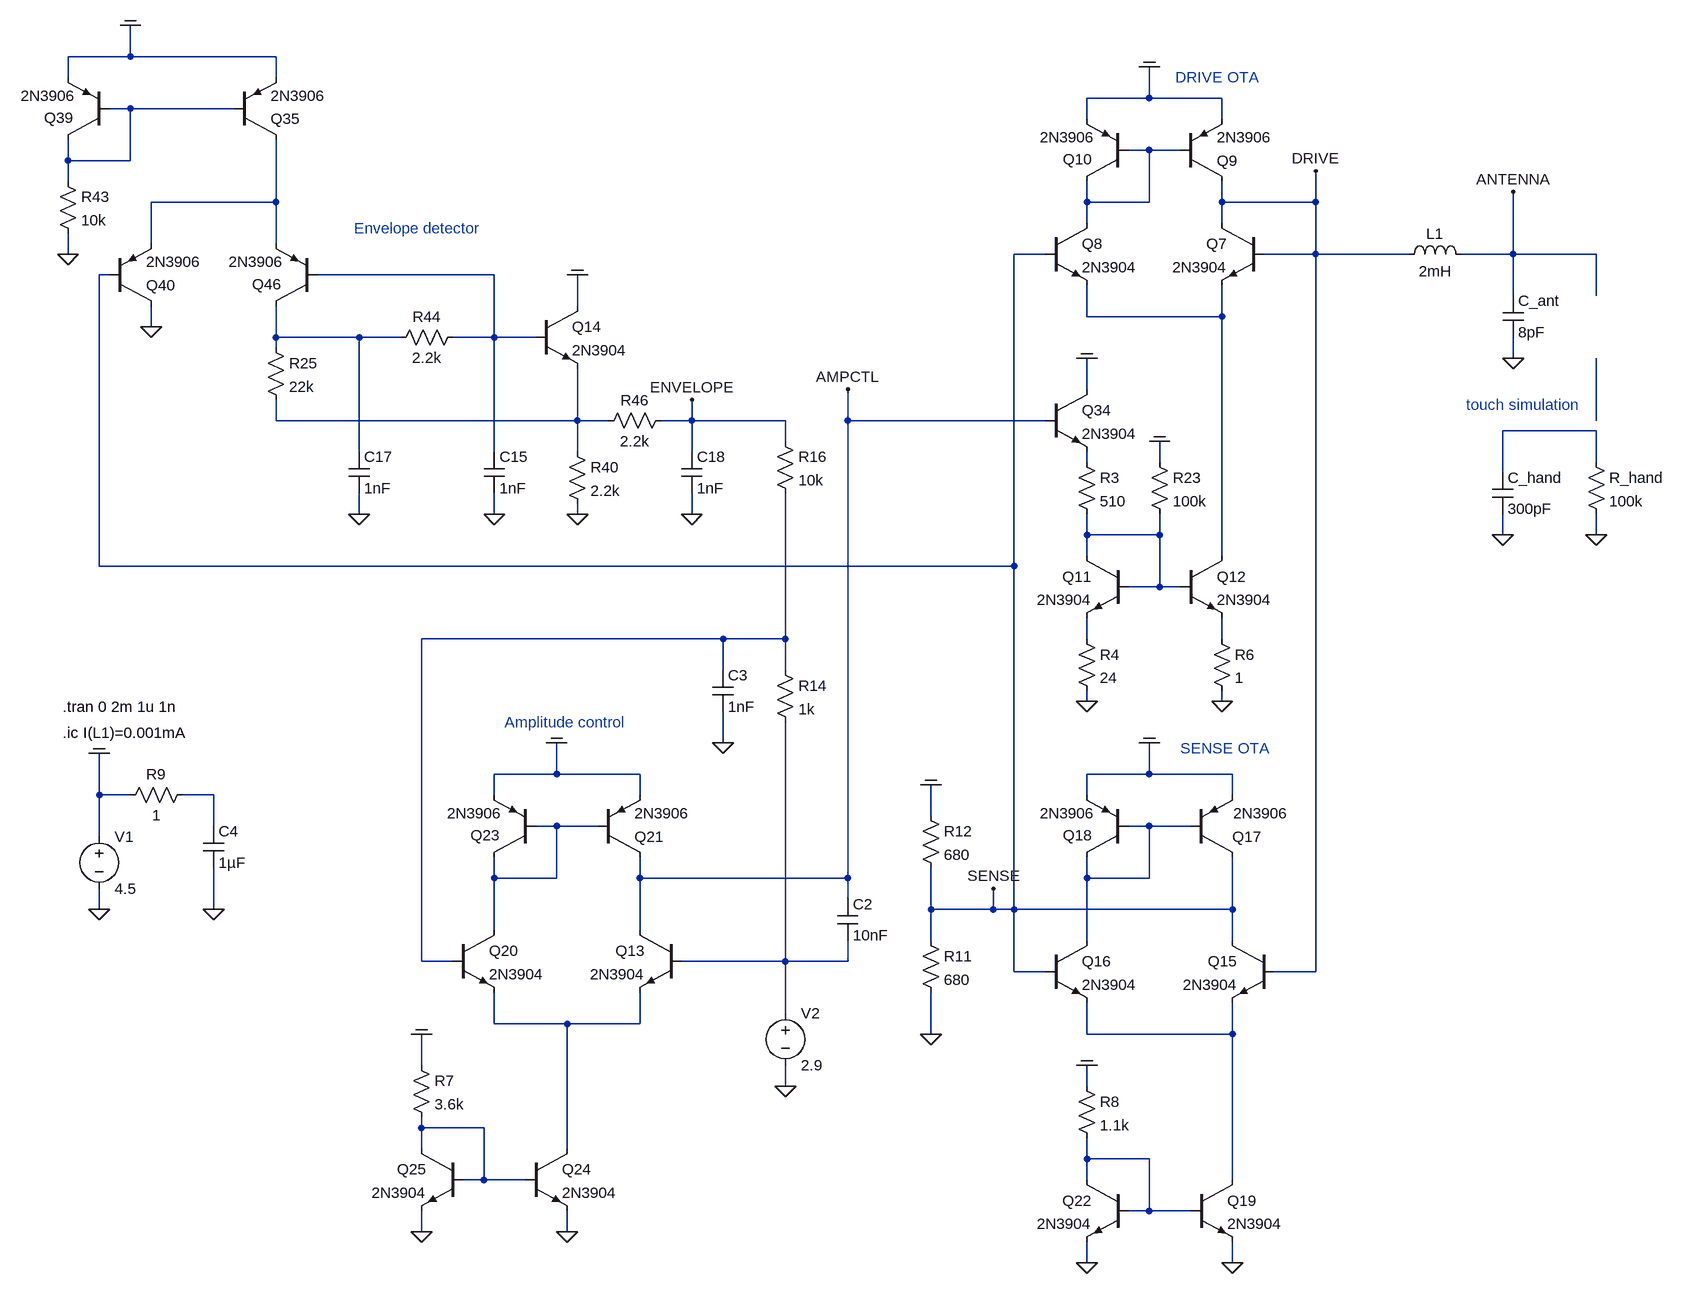
[diagram p0: schematic bjt_current_sensing_oscillator_ota_v8.asc]
bjt_current_sensing_oscillator_ota_v8.asc, the LTspice schematic file:
Version 4
SHEET 1 4648 5684
WIRE -624 1456 -624 1408
WIRE -624 1456 -720 1456
WIRE -400 1456 -624 1456
WIRE -720 1488 -720 1456
WIRE -400 1488 -400 1456
WIRE 944 1520 944 1472
WIRE 944 1520 848 1520
WIRE 1056 1520 944 1520
WIRE -624 1536 -656 1536
WIRE -464 1536 -624 1536
WIRE 848 1552 848 1520
WIRE 1056 1552 1056 1520
WIRE 944 1600 912 1600
WIRE 992 1600 944 1600
WIRE -720 1616 -720 1584
WIRE -624 1616 -624 1536
WIRE -624 1616 -720 1616
WIRE -720 1648 -720 1616
WIRE -400 1680 -400 1584
WIRE -400 1680 -592 1680
WIRE 848 1680 848 1648
WIRE 944 1680 944 1600
WIRE 944 1680 848 1680
WIRE 1056 1680 1056 1648
WIRE 1200 1680 1200 1632
WIRE 1200 1680 1056 1680
WIRE 848 1712 848 1680
WIRE 1056 1712 1056 1680
WIRE -592 1744 -592 1680
WIRE -400 1744 -400 1680
WIRE -720 1760 -720 1728
WIRE 784 1760 736 1760
WIRE 1200 1760 1200 1680
WIRE 1200 1760 1120 1760
WIRE 1344 1760 1200 1760
WIRE 1504 1760 1504 1664
WIRE 1504 1760 1424 1760
WIRE 1632 1760 1504 1760
WIRE -656 1792 -672 1792
WIRE -64 1792 -336 1792
WIRE 1504 1824 1504 1760
WIRE 1632 1824 1632 1760
WIRE 64 1840 64 1792
WIRE 848 1856 848 1808
WIRE 1056 1856 1056 1808
WIRE 1056 1856 848 1856
WIRE -592 1872 -592 1840
WIRE -400 1888 -400 1840
WIRE -272 1888 -400 1888
WIRE -208 1888 -272 1888
WIRE -64 1888 -64 1792
WIRE -64 1888 -128 1888
WIRE 0 1888 -64 1888
WIRE -400 1904 -400 1888
WIRE 1504 1920 1504 1888
WIRE 848 1968 848 1920
WIRE -400 2016 -400 1984
WIRE 64 2016 64 1936
WIRE 64 2016 -400 2016
WIRE 112 2016 64 2016
WIRE 240 2016 240 1984
WIRE 240 2016 192 2016
WIRE 384 2016 240 2016
WIRE 480 2016 480 1968
WIRE 784 2016 480 2016
WIRE 1632 2016 1632 1920
WIRE 1632 2032 1488 2032
WIRE 384 2048 384 2016
WIRE -272 2064 -272 1888
WIRE -64 2064 -64 1888
WIRE 64 2064 64 2016
WIRE 240 2064 240 2016
WIRE 848 2080 848 2064
WIRE 960 2080 960 2048
WIRE 1632 2080 1632 2032
WIRE 1488 2096 1488 2032
WIRE -272 2160 -272 2128
WIRE -64 2160 -64 2128
WIRE 64 2160 64 2144
WIRE 240 2160 240 2128
WIRE 848 2192 848 2160
WIRE 960 2192 960 2160
WIRE 960 2192 848 2192
WIRE 1488 2192 1488 2160
WIRE 1632 2192 1632 2160
WIRE 848 2224 848 2192
WIRE 1056 2224 1056 1856
WIRE -672 2240 -672 1792
WIRE 736 2240 736 1760
WIRE 736 2240 -672 2240
WIRE 960 2272 960 2192
WIRE 960 2272 912 2272
WIRE 992 2272 960 2272
WIRE 288 2352 -176 2352
WIRE 384 2352 384 2128
WIRE 384 2352 288 2352
WIRE 848 2352 848 2320
WIRE 1056 2352 1056 2320
WIRE 288 2400 288 2352
WIRE 384 2400 384 2352
WIRE 848 2448 848 2432
WIRE 1056 2448 1056 2432
WIRE 288 2512 288 2464
WIRE 32 2560 32 2512
WIRE 32 2560 -64 2560
WIRE 160 2560 32 2560
WIRE 944 2560 944 2512
WIRE 944 2560 848 2560
WIRE 1072 2560 944 2560
WIRE -672 2592 -672 2528
WIRE -624 2592 -672 2592
WIRE -496 2592 -544 2592
WIRE -64 2592 -64 2560
WIRE 160 2592 160 2560
WIRE 848 2592 848 2560
WIRE 1072 2592 1072 2560
WIRE 608 2624 608 2576
WIRE -496 2640 -496 2592
WIRE 32 2640 0 2640
WIRE 96 2640 32 2640
WIRE 944 2640 912 2640
WIRE 1008 2640 944 2640
WIRE -672 2656 -672 2592
WIRE -64 2720 -64 2688
WIRE 32 2720 32 2640
WIRE 32 2720 -64 2720
WIRE 160 2720 160 2688
WIRE 480 2720 480 2016
WIRE 480 2720 160 2720
WIRE 848 2720 848 2688
WIRE 944 2720 944 2640
WIRE 944 2720 848 2720
WIRE 480 2752 480 2720
WIRE -672 2768 -672 2736
WIRE -496 2768 -496 2704
WIRE 608 2768 608 2704
WIRE 704 2768 704 2736
WIRE 704 2768 608 2768
WIRE 736 2768 736 2240
WIRE 736 2768 704 2768
WIRE 1072 2768 1072 2688
WIRE 1072 2768 736 2768
WIRE -64 2800 -64 2720
WIRE 160 2800 160 2720
WIRE 608 2816 608 2768
WIRE 848 2816 848 2720
WIRE 1072 2816 1072 2768
WIRE -176 2848 -176 2352
WIRE -128 2848 -176 2848
WIRE 384 2848 384 2480
WIRE 384 2848 224 2848
WIRE 480 2848 480 2816
WIRE 480 2848 384 2848
WIRE 736 2864 736 2768
WIRE 784 2864 736 2864
WIRE 1200 2864 1200 1760
WIRE 1200 2864 1136 2864
WIRE 384 2928 384 2848
WIRE -64 2944 -64 2896
WIRE 48 2944 -64 2944
WIRE 160 2944 160 2896
WIRE 160 2944 48 2944
WIRE 608 2960 608 2896
WIRE 848 2960 848 2912
WIRE 1072 2960 1072 2912
WIRE 1072 2960 848 2960
WIRE -176 3008 -176 2960
WIRE 384 3040 384 3008
WIRE 848 3040 848 3008
WIRE -176 3104 -176 3088
WIRE -80 3104 -176 3104
WIRE -176 3136 -176 3104
WIRE 48 3136 48 2944
WIRE 848 3152 848 3120
WIRE 944 3152 848 3152
WIRE -80 3184 -80 3104
WIRE -80 3184 -112 3184
WIRE -16 3184 -80 3184
WIRE 848 3184 848 3152
WIRE 1072 3184 1072 2960
WIRE 944 3232 944 3152
WIRE 944 3232 912 3232
WIRE 1008 3232 944 3232
WIRE -176 3264 -176 3232
WIRE 48 3264 48 3232
WIRE 848 3312 848 3280
WIRE 1072 3312 1072 3280
FLAG 1504 1920 0
FLAG 1504 1664 ANTENNA
FLAG -672 2768 0
FLAG -672 2528 COM
FLAG 1488 2192 0
FLAG 1632 2192 0
FLAG -496 2768 0
FLAG 944 1472 COM
FLAG 944 2512 COM
FLAG 1072 3312 0
FLAG 848 3008 COM
FLAG 608 2960 0
FLAG 608 2576 COM
FLAG 704 2736 SENSE
FLAG 848 2448 0
FLAG 1056 2448 0
FLAG 960 2048 COM
FLAG -624 1408 COM
FLAG -272 2160 0
FLAG -720 1760 0
FLAG -592 1872 0
FLAG 64 1792 COM
FLAG 64 2160 0
FLAG -64 2160 0
FLAG 848 1920 COM
FLAG 240 2160 0
FLAG 32 2512 COM
FLAG 48 3264 0
FLAG -176 2960 COM
FLAG -176 3264 0
FLAG 384 3040 0
FLAG 288 2512 0
FLAG 848 3312 0
FLAG 240 1984 ENVELOPE
FLAG 480 1968 AMPCTL
FLAG 1200 1632 DRIVE
SYMBOL ind 1328 1776 R270
WINDOW 0 32 56 VTop 2
WINDOW 3 5 56 VBottom 2
SYMATTR InstName L1
SYMATTR Value 2mH
SYMATTR SpiceLine Ipk=100m Rser=120 Rpar=10Meg Cpar=1pF
SYMBOL cap 1488 1824 R0
SYMATTR InstName C_ant
SYMATTR Value 8pF
SYMBOL voltage -672 2640 R0
WINDOW 123 0 0 Left 0
WINDOW 39 0 0 Left 0
SYMATTR InstName V1
SYMATTR Value 4.5
SYMBOL cap 1472 2096 R0
SYMATTR InstName C_hand
SYMATTR Value 300pF
SYMBOL res 1616 2064 R0
WINDOW 0 36 40 Left 2
WINDOW 3 36 76 Left 2
SYMATTR InstName R_hand
SYMATTR Value 100k
SYMBOL cap -512 2640 R0
SYMATTR InstName C4
SYMATTR Value 1µF
SYMBOL res -528 2576 R90
WINDOW 0 0 56 VBottom 2
WINDOW 3 32 56 VTop 2
SYMATTR InstName R9
SYMATTR Value 1
SYMBOL npn 1120 1712 M0
SYMATTR InstName Q7
SYMATTR Value 2N3904
SYMBOL npn 784 1712 R0
SYMATTR InstName Q8
SYMATTR Value 2N3904
SYMBOL pnp 992 1648 M180
SYMATTR InstName Q9
SYMATTR Value 2N3906
SYMBOL pnp 912 1648 R180
WINDOW 0 55 34 Left 2
WINDOW 3 52 68 Left 2
SYMATTR InstName Q10
SYMATTR Value 2N3906
SYMBOL npn 1136 2816 M0
SYMATTR InstName Q15
SYMATTR Value 2N3904
SYMBOL npn 784 2816 R0
SYMATTR InstName Q16
SYMATTR Value 2N3904
SYMBOL pnp 1008 2688 M180
WINDOW 0 64 32 Left 2
WINDOW 3 65 68 Left 2
SYMATTR InstName Q17
SYMATTR Value 2N3906
SYMBOL pnp 912 2688 R180
WINDOW 0 55 34 Left 2
WINDOW 3 52 68 Left 2
SYMATTR InstName Q18
SYMATTR Value 2N3906
SYMBOL npn 1008 3184 R0
SYMATTR InstName Q19
SYMATTR Value 2N3904
SYMBOL res 832 3024 R0
WINDOW 0 36 40 Left 2
WINDOW 3 36 76 Left 2
SYMATTR InstName R8
SYMATTR Value 1.1k
SYMBOL npn 912 3184 M0
SYMATTR InstName Q22
SYMATTR Value 2N3904
SYMBOL res 592 2800 R0
WINDOW 0 36 40 Left 2
WINDOW 3 36 76 Left 2
SYMATTR InstName R11
SYMATTR Value 680
SYMBOL res 592 2608 R0
WINDOW 0 36 40 Left 2
WINDOW 3 36 76 Left 2
SYMATTR InstName R12
SYMATTR Value 680
SYMBOL res 832 2064 R0
WINDOW 0 36 40 Left 2
WINDOW 3 36 76 Left 2
SYMATTR InstName R3
SYMATTR Value 510
SYMBOL npn 912 2224 M0
SYMATTR InstName Q11
SYMATTR Value 2N3904
SYMBOL npn 992 2224 R0
SYMATTR InstName Q12
SYMATTR Value 2N3904
SYMBOL res 832 2336 R0
WINDOW 0 36 40 Left 2
WINDOW 3 36 76 Left 2
SYMATTR InstName R4
SYMATTR Value 24
SYMBOL res 1040 2336 R0
WINDOW 0 36 40 Left 2
WINDOW 3 36 76 Left 2
SYMATTR InstName R6
SYMATTR Value 1
SYMBOL res 944 2064 R0
WINDOW 0 36 40 Left 2
WINDOW 3 36 76 Left 2
SYMATTR InstName R23
SYMATTR Value 100k
SYMBOL pnp -464 1584 M180
SYMATTR InstName Q35
SYMATTR Value 2N3906
SYMBOL pnp -656 1584 R180
WINDOW 0 55 34 Left 2
WINDOW 3 52 68 Left 2
SYMATTR InstName Q39
SYMATTR Value 2N3906
SYMBOL pnp -656 1840 M180
SYMATTR InstName Q40
SYMATTR Value 2N3906
SYMBOL pnp -336 1840 R180
WINDOW 0 55 34 Left 2
WINDOW 3 52 68 Left 2
SYMATTR InstName Q46
SYMATTR Value 2N3906
SYMBOL res -416 1888 R0
WINDOW 0 36 40 Left 2
WINDOW 3 36 76 Left 2
SYMATTR InstName R25
SYMATTR Value 22k
SYMBOL cap -288 2064 R0
SYMATTR InstName C17
SYMATTR Value 1nF
SYMBOL res -736 1632 R0
WINDOW 0 36 40 Left 2
WINDOW 3 36 76 Left 2
SYMATTR InstName R43
SYMATTR Value 10k
SYMBOL npn 0 1840 R0
SYMATTR InstName Q14
SYMATTR Value 2N3904
SYMBOL res 48 2048 R0
WINDOW 0 36 40 Left 2
WINDOW 3 36 76 Left 2
SYMATTR InstName R40
SYMATTR Value 2.2k
SYMBOL res -112 1872 R90
WINDOW 0 0 56 VBottom 2
WINDOW 3 32 56 VTop 2
SYMATTR InstName R44
SYMATTR Value 2.2k
SYMBOL cap -80 2064 R0
SYMATTR InstName C15
SYMATTR Value 1nF
SYMBOL cap 224 2064 R0
SYMATTR InstName C18
SYMATTR Value 1nF
SYMBOL res 208 2000 R90
WINDOW 0 0 56 VBottom 2
WINDOW 3 32 56 VTop 2
SYMATTR InstName R46
SYMATTR Value 2.2k
SYMBOL npn 784 1968 R0
SYMATTR InstName Q34
SYMATTR Value 2N3904
SYMBOL npn 224 2800 M0
SYMATTR InstName Q13
SYMATTR Value 2N3904
SYMBOL npn -128 2800 R0
SYMATTR InstName Q20
SYMATTR Value 2N3904
SYMBOL pnp 96 2688 M180
SYMATTR InstName Q21
SYMATTR Value 2N3906
SYMBOL pnp 0 2688 R180
WINDOW 0 55 34 Left 2
WINDOW 3 52 68 Left 2
SYMATTR InstName Q23
SYMATTR Value 2N3906
SYMBOL npn -16 3136 R0
SYMATTR InstName Q24
SYMATTR Value 2N3904
SYMBOL res -192 2992 R0
WINDOW 0 36 40 Left 2
WINDOW 3 36 76 Left 2
SYMATTR InstName R7
SYMATTR Value 3.6k
SYMBOL npn -112 3136 M0
SYMATTR InstName Q25
SYMATTR Value 2N3904
SYMBOL cap 464 2752 R0
SYMATTR InstName C2
SYMATTR Value 10nF
SYMBOL voltage 384 2912 R0
WINDOW 123 0 0 Left 0
WINDOW 39 0 0 Left 0
SYMATTR InstName V2
SYMATTR Value 2.9
SYMBOL res 368 2384 R0
WINDOW 0 36 40 Left 2
WINDOW 3 36 76 Left 2
SYMATTR InstName R14
SYMATTR Value 1k
SYMBOL res 368 2032 R0
WINDOW 0 36 40 Left 2
WINDOW 3 36 76 Left 2
SYMATTR InstName R16
SYMATTR Value 10k
SYMBOL cap 272 2400 R0
SYMATTR InstName C3
SYMATTR Value 1nF
TEXT -728 2456 Left 2 !.tran 0 2m 1u 1n
TEXT -728 2496 Left 2 !.ic I(L1)=0.001mA
TEXT 1432 1992 Left 2 ;touch simulation
TEXT -280 1720 Left 2 ;Envelope detector
TEXT -48 2480 Left 2 ;Amplitude control
TEXT 984 1488 Left 2 ;DRIVE OTA
TEXT 992 2520 Left 2 ;SENSE OTA

The netlist it stands for:
* bjt_current_sensing_oscillator_ota_v8.asc
L1 DRIVE ANTENNA 2mH Ipk=100m Rser=120 Rpar=10Meg Cpar=1pF
C_ant ANTENNA 0 8pF
V1 COM 0 4.5
C_hand N009 0 300pF
R_hand N009 0 100k
C4 N015 0 1µF
R9 N015 COM 1
Q7 DRIVE DRIVE N005 0 2N3904
Q8 N002 SENSE N005 0 2N3904
Q9 DRIVE N002 COM 0 2N3906
Q10 N002 N002 COM 0 2N3906
Q15 SENSE DRIVE N020 0 2N3904
Q16 N017 SENSE N020 0 2N3904
Q17 SENSE N017 COM 0 2N3906
Q18 N017 N017 COM 0 2N3906
Q19 N020 N022 0 0 2N3904
R8 COM N022 1.1k
Q22 N022 N022 0 0 2N3904
R11 SENSE 0 680
R12 COM SENSE 680
R3 N010 N011 510
Q11 N011 N011 N013 0 2N3904
Q12 N005 N011 N014 0 2N3904
R4 N013 0 24
R6 N014 0 1
R23 COM N011 100k
Q35 N003 N001 COM 0 2N3906
Q39 N001 N001 COM 0 2N3906
Q40 0 SENSE N003 0 2N3906
Q46 N006 N004 N003 0 2N3906
R25 N006 N007 22k
C17 N006 0 1nF
R43 N001 0 10k
Q14 COM N004 N007 0 2N3904
R40 N007 0 2.2k
R44 N004 N006 2.2k
C15 N004 0 1nF
C18 ENVELOPE 0 1nF
R46 ENVELOPE N007 2.2k
Q34 COM AMPCTL N010 0 2N3904
Q13 AMPCTL N018 N019 0 2N3904
Q20 N016 N012 N019 0 2N3904
Q21 AMPCTL N016 COM 0 2N3906
Q23 N016 N016 COM 0 2N3906
Q24 N019 N021 0 0 2N3904
R7 COM N021 3.6k
Q25 N021 N021 0 0 2N3904
C2 AMPCTL N018 10nF
V2 N018 0 2.9
R14 N012 N018 1k
R16 ENVELOPE N012 10k
C3 N012 0 1nF
.model NPN NPN
.model PNP PNP
.lib standard.bjt
.tran 0 2m 1u 1n
.ic I(L1)=0.001mA
* touch simulation
* Envelope detector
* Amplitude control
* DRIVE OTA
* SENSE OTA
.backanno
.end